# EAGLE design ECU_1A (EAGLE 7.7.0)
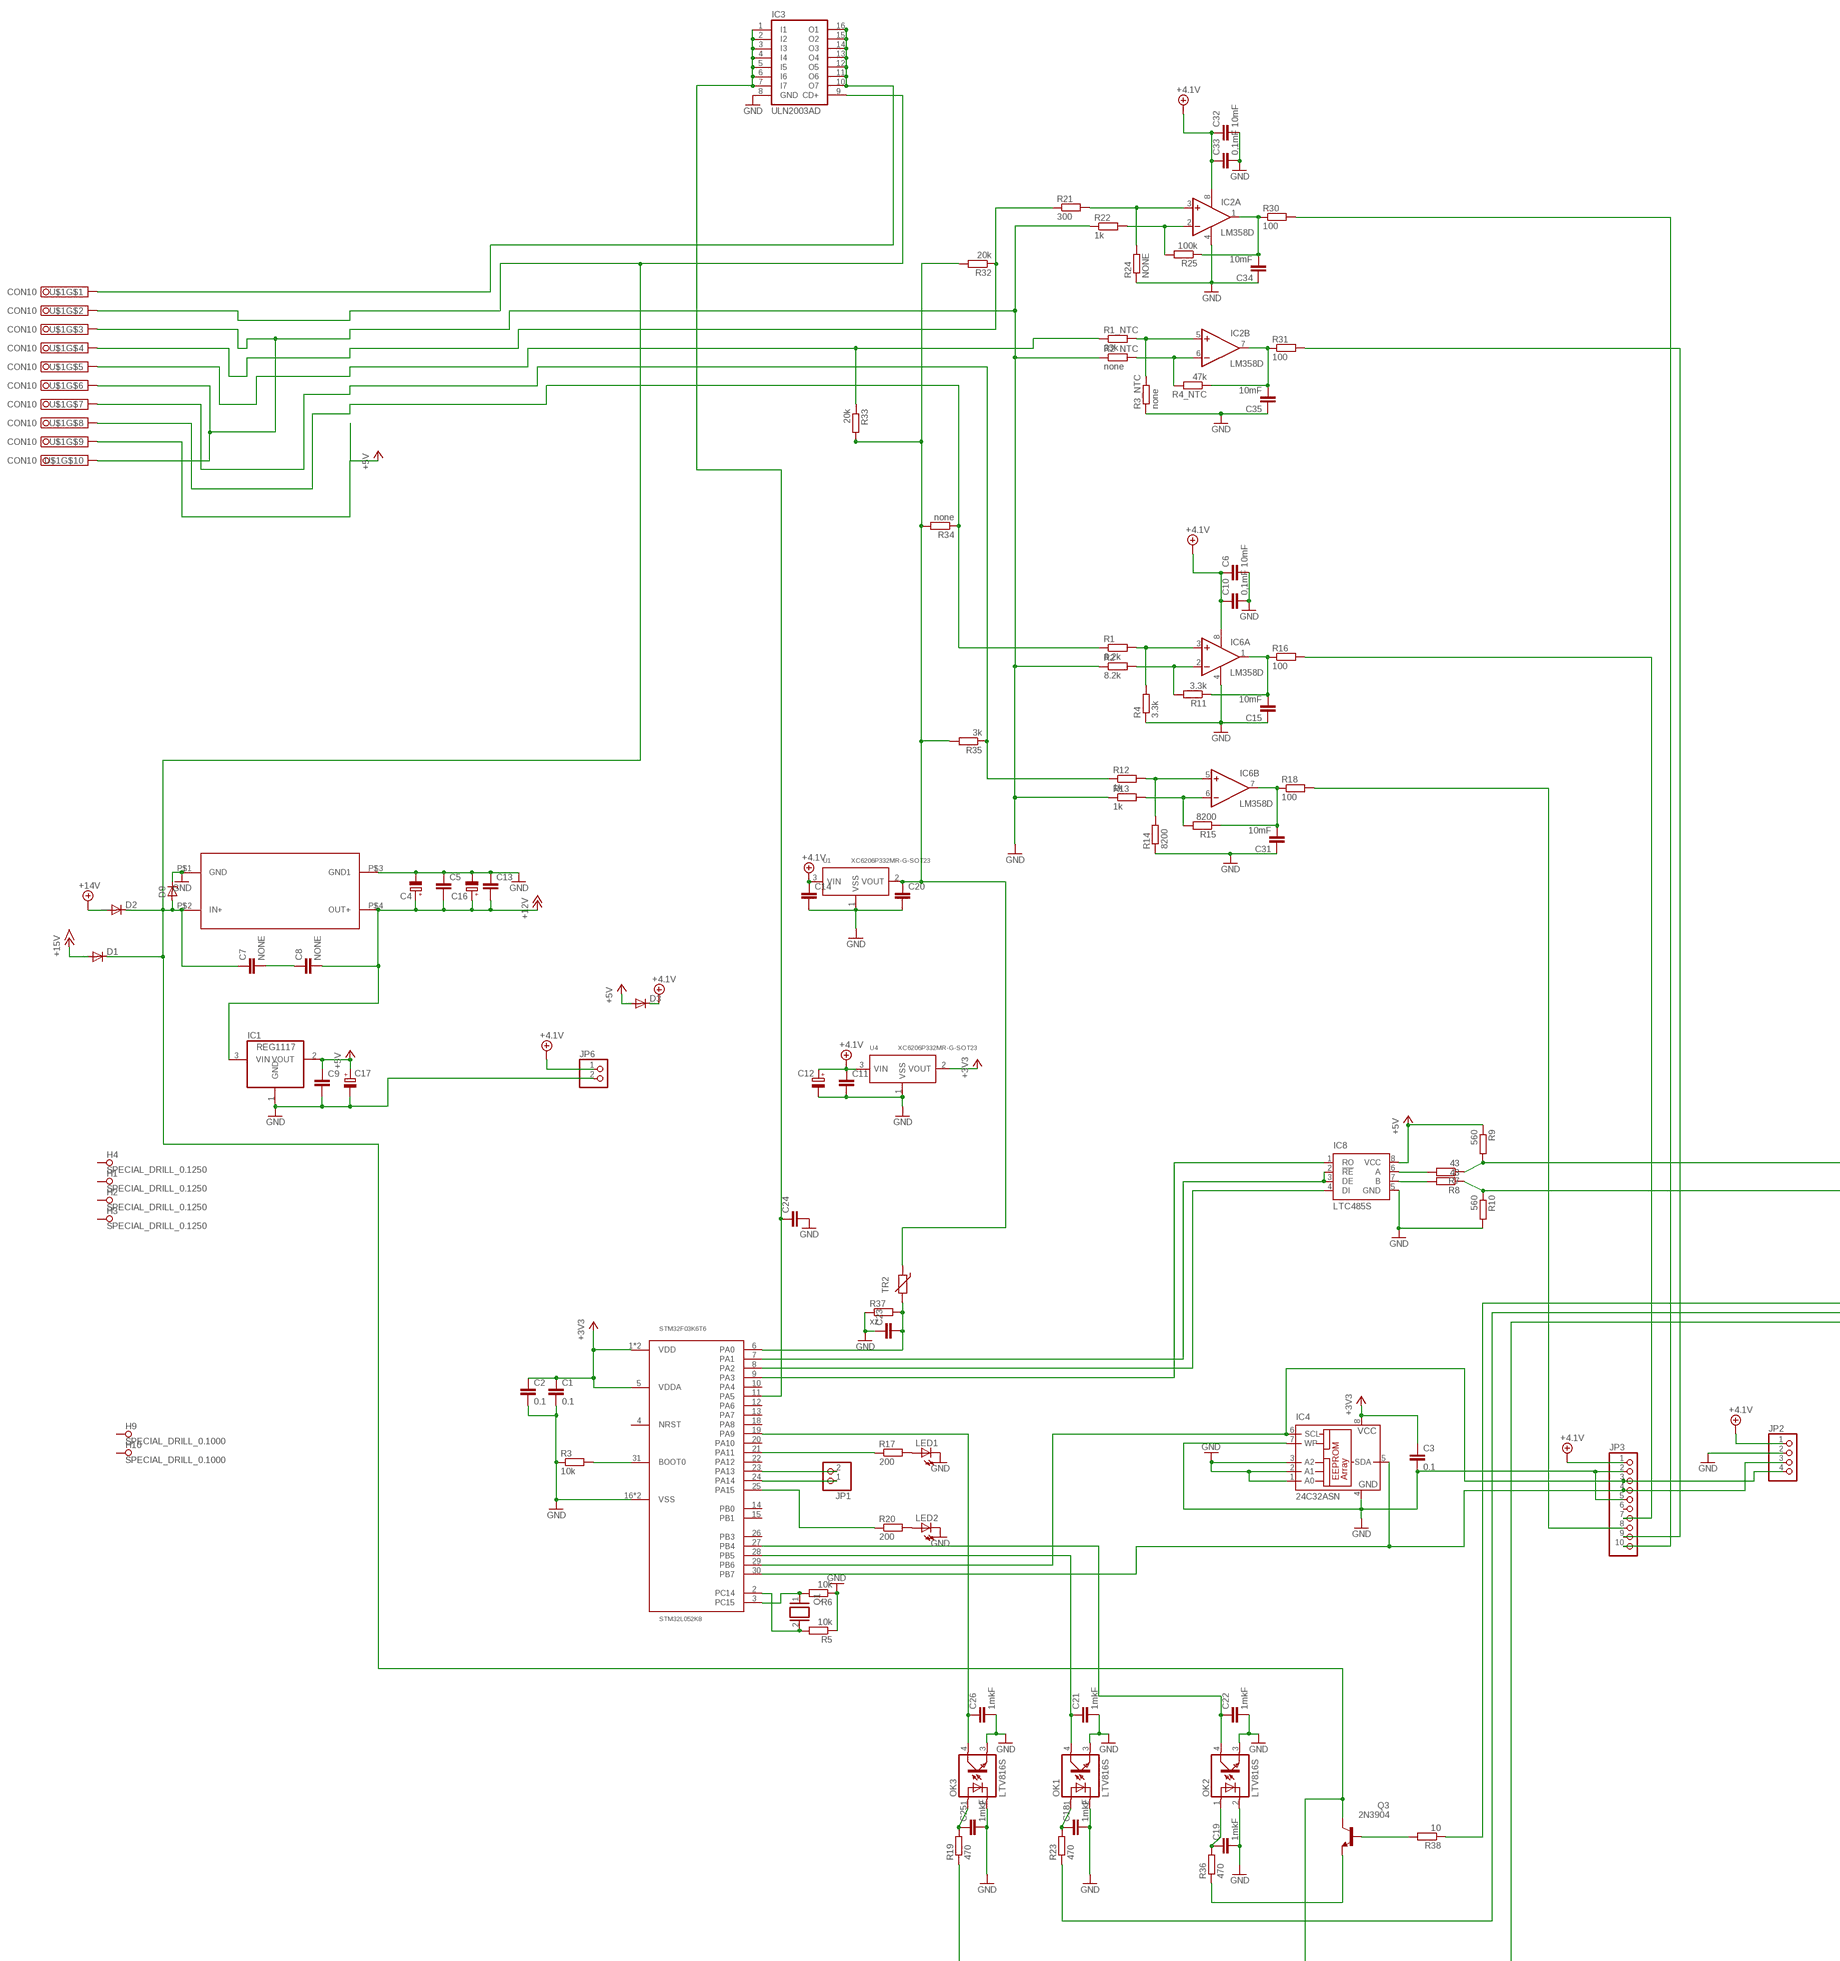
[diagram p0: schematic, sheet 1, part 1 of 3]
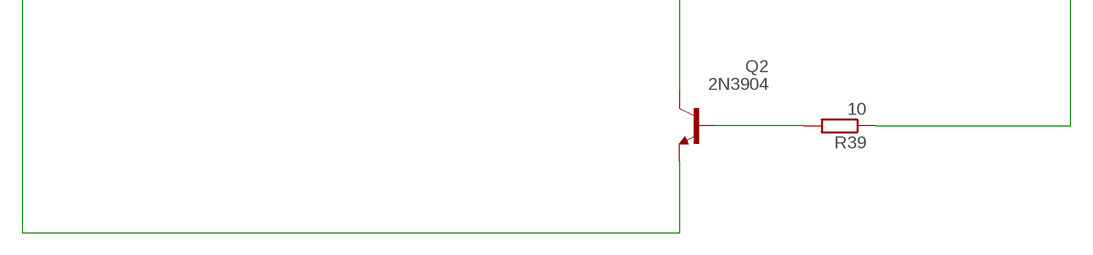
[diagram p1: schematic, sheet 1, part 2 of 3]
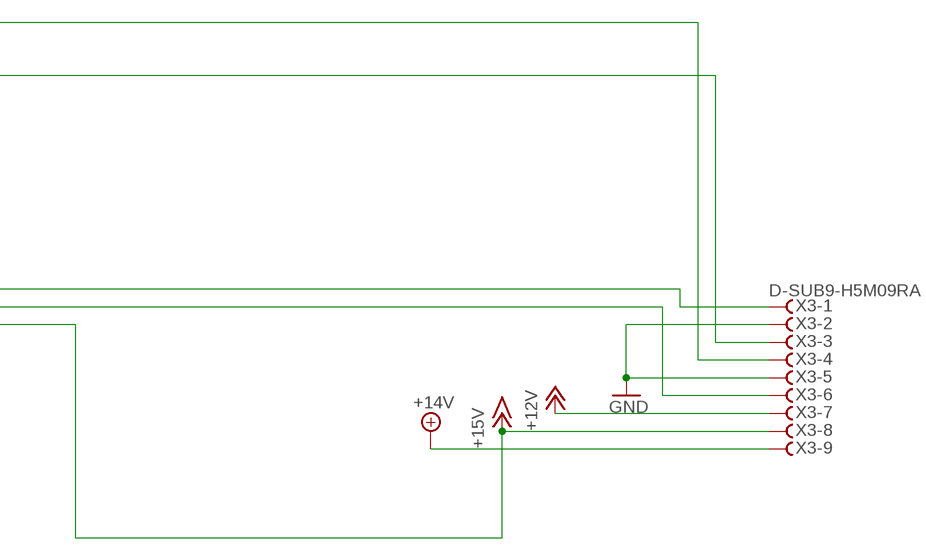
[diagram p2: schematic, sheet 1, part 3 of 3]

## Parts
C1  0.1  C-EUC0805  [C0805]
C2  0.1  C-EUC0805  [C0805]
C3  0.1  C-EUC0805  [C0805]
C4  CPOL-EUE2.5-6  [E2,5-6]
C5  C-EUC0805  [C0805]
C6  10mF  C-EUC0805  [C0805]
C7  NONE  C-EUC0805  [C0805]
C8  NONE  C-EUC0805  [C0805]
C9  C-EUC0805  [C0805]
C10  0,1mF  C-EUC0805  [C0805]
C11  C-EUC0805  [C0805]
C12  CPOL-EUE2.5-6  [E2,5-6]
C13  C-EUC0805  [C0805]
C14  C-EUC0805  [C0805]
C15  10mF  C-EUC0805  [C0805]
C16  CPOL-EUE5-10.5  [E5-10,5]
C17  CPOL-EUE2,5-6E  [E2,5-6E]
C18  1mkF  C-EUC0805  [C0805]
C19  1mkF  C-EUC0805  [C0805]
C20  C-EUC0805  [C0805]
C21  1mkF  C-EUC0805  [C0805]
C22  1mkF  C-EUC0805  [C0805]
C23  C-EUC0805  [C0805]
C24  C-EUC0805  [C0805]
C25  1mkF  C-EUC0805  [C0805]
C26  1mkF  C-EUC0805  [C0805]
C31  10mF  C-EUC0805  [C0805]
C32  10mF  C-EUC0805  [C0805]
C33  0,1mF  C-EUC0805  [C0805]
C34  10mF  C-EUC0805  [C0805]
C35  10mF  C-EUC0805  [C0805]
D1  DIODE-DO-214AC  [DO-214AC]
D2  DIODE-DO-214AC  [DO-214AC]
D3  DIODE-DO-214AC  [DO-214AC]
D9  ZENER-DIODEZD-7.5  [ZDIO-7.5]
H1  SPECIAL_DRILL_0.1250  [PAD_0.1250]
H2  SPECIAL_DRILL_0.1250  [PAD_0.1250]
H3  SPECIAL_DRILL_0.1250  [PAD_0.1250]
H4  SPECIAL_DRILL_0.1250  [PAD_0.1250]
H9  SPECIAL_DRILL_0.1000  [PAD_0.1000]
H10  SPECIAL_DRILL_0.1000  [PAD_0.1000]
IC1  REG1117  [SOT223]
IC2  LM358D  [SO08]
IC3  ULN2003AD  [SO16]
IC4  24C32ASN  [SO-08]
IC6  LM358D  [SO08]
IC8  LTC485S  [SOIC8]
JP1  PINHD-1X2  [1X02]
JP2  PINHD-1X4  [1X04]
JP3  PINHD-1X10  [1X10]
JP6  PINHD-1X2  [1X02]
LED1  LEDCHIPLED_1206  [CHIPLED_1206]
LED2  LEDCHIPLED_1206  [CHIPLED_1206]
OK1  LTV816S  [SMD4]
OK2  LTV816S  [SMD4]
OK3  LTV816S  [SMD4]
Q1  XTAL/S  [QS]
Q2  2N3904  [TO92]
Q3  2N3904  [TO92]
R1  8.2k  R-EU_R0805  [R0805]
R1_NTC  33k  R-EU_R0805  [R0805]
R2  8.2k  R-EU_R0805  [R0805]
R2_NTC  none  R-EU_R0805  [R0805]
R3  10k  R-EU_R0805  [R0805]
R3_NTC  none  R-EU_R0805  [R0805]
R4  3.3k  R-EU_R0805  [R0805]
R4_NTC  47k  R-EU_R0805  [R0805]
R5  10k  R-EU_R0805  [R0805]
R6  10k  R-EU_R0805  [R0805]
R7  43  R-EU_R0805  [R0805]
R8  43  R-EU_R0805  [R0805]
R9  560  R-EU_R0805  [R0805]
R10  560  R-EU_R0805  [R0805]
R11  3.3k  R-EU_R0805  [R0805]
R12  1k  R-EU_R0805  [R0805]
R13  1k  R-EU_R0805  [R0805]
R14  8200  R-EU_R0805  [R0805]
R15  8200  R-EU_R0805  [R0805]
R16  100  R-EU_R0805  [R0805]
R17  200  R-EU_R0805  [R0805]
R18  100  R-EU_R0805  [R0805]
R19  470  R-EU_R0805  [R0805]
R20  200  R-EU_R0805  [R0805]
R21  300  R-EU_R0805  [R0805]
R22  1k  R-EU_R0805  [R0805]
R23  470  R-EU_R0805  [R0805]
R24  NONE  R-EU_R0805  [R0805]
R25  100k  R-EU_R0805  [R0805]
R30  100  R-EU_R0805  [R0805]
R31  100  R-EU_R0805  [R0805]
R32  20k  R-EU_R0805  [R0805]
R33  20k  R-EU_R0805  [R0805]
R34  none  R-EU_R0805  [R0805]
R35  3k  R-EU_R0805  [R0805]
R36  470  R-EU_R0805  [R0805]
R37  xz  R-EU_R0805  [R0805]
R38  10  R-EU_R0805  [R0805]
R39  10  R-EU_R0805  [R0805]
STM32F03K6T6  STM32L052K8  [LQFP32-7X7]
TR2  THERMISTOR_R-2,5  [RS-2,5]
U1  XC6206P332MR-G-SOT23  PMIC-LDO-XC6206P332MR-G(SOT23)  [SOT-23]
U4  XC6206P332MR-G-SOT23  PMIC-LDO-XC6206P332MR-G(SOT23)  [SOT-23]
U$1  CON10  [CON10]
U$2  DC24_DC5  [SLIM_MOUNT]
X3  D-SUB9-H5M09RA  [H5M09RA]

## Nets
3.3V_SENSORS: C20.1 R32.2 R33.2 R34.2 R35.2 TR2.1 U1.2(VOUT)
+3V3: C1.1 C2.1 C3.1 IC4.8(VCC) STM32F03K6T6.1(VDD) STM32F03K6T6.5(VDDA) STM32F03K6T6.17(VDD) U4.2(VOUT)
+4.1V: C6.1 C10.1 C11.1 C12.+ C14.1 C32.1 C33.1 D3.C IC2.8(P:V+) IC6.8(P:V+) JP2.1 JP3.1 JP6.1 U1.3(VIN) U4.3(VIN)
+5V: C9.1 C17.+ D3.A IC1.2(VOUT) IC8.8(VCC) R9.1 U$1.9
+12V: C4.+ C5.2 C8.2 C13.2 C16.+ IC1.3(VIN) U$2.P$4(OUT+) X3.7
+14V: D2.A X3.9
+15V: D1.A R39.1 X3.8
A: IC8.6(A) R7.2
A1_5V_PRESS: JP3.7 R16.2
A3_NTC_10K: JP3.9 R31.2
A4_TERMO_K-TYPE: JP3.10 R30.2
AIN_3: R1_NTC.1 R33.1 U$1.5
AIN_4: R21.1 R32.1 U$1.4
B: IC8.7(B) R8.2
DE_UART: IC8.2(!RE) IC8.3(DE) STM32F03K6T6.7(PA1)
DI1_IN: C21.1 OK1.4(COL) STM32F03K6T6.28(PB5)
DI2_IN: C22.1 OK2.4(COL) STM32F03K6T6.27(PB4)
DI3_IN: C26.1 OK3.4(COL) STM32F03K6T6.19(PA9)
DI_1: R23.1 X3.6
DI_2: R38.1 X3.1
FLVL: JP3.8 R18.2
GND: C1.2 C2.2 C3.2 C4.- C5.1 C6.2 C9.2 C10.2 C11.2 C12.- C13.1 C14.2 C15.1 C16.- C17.- C18.2 C19.2 C20.2 C21.2 C22.2 C23.1 C24.2 C25.2 C26.2 C31.1 C32.2 C33.2 C34.1 C35.1 D9.C IC1.1(GND) IC2.4(P:V-) IC3.8(GND) IC4.1(A0) IC4.2(A1) IC4.3(A2) IC4.4(GND) IC4.7(WP) IC6.4(P:V-) IC8.5(GND) JP2.2 JP3.2 JP3.5 JP6.2 LED1.C LED2.C OK1.2(C) OK1.3(EMIT) OK2.2(C) OK2.3(EMIT) OK3.2(C) OK3.3(EMIT) R2.1 R2_NTC.1 R3.1 R3_NTC.1 R4.1 R5.1 R6.1 R10.2 R13.1 R14.1 R22.1 R24.1 R37.1 STM32F03K6T6.16(VSS) STM32F03K6T6.32(VSS) U1.1(VSS) U4.1(VSS) U$1.3 U$1.6 U$1.10 U$2.P$1(GND) U$2.P$3(GND1) X3.2 X3.5
LED1: R17.1 STM32F03K6T6.21(PA11)
LED2: R20.1 STM32F03K6T6.25(PA15)
N$1: Q1.2 R5.2 STM32F03K6T6.2(PC14)
N$2: C7.2 C8.1
N$3: R3.2 STM32F03K6T6.31(BOOT0)
N$4: C25.1 OK3.1(A) R19.2
N$5: Q1.1 R6.2 STM32F03K6T6.3(PC15)
N$6: IC6.3(A:+IN) R1.2 R4.2
N$9: JP1.2 STM32F03K6T6.23(PA13)
N$10: LED1.A R17.2
N$11: LED2.A R20.2
N$13: C19.1 OK2.1(A) R36.2
N$14: C18.1 OK1.1(A) R23.2
N$16: IC6.2(A:-IN) R2.2 R11.2
N$17: C23.2 R37.2 STM32F03K6T6.6(PA0) TR2.2
N$19: JP1.1 STM32F03K6T6.24(PA14)
N$20: Q3.3(E) R36.1
N$21: Q3.2(B) R38.2
N$22: C15.2 IC6.1(A:OUT) R11.1 R16.1
N$23: R12.1 R35.1 U$1.7
N$24: Q2.2(B) R39.2
N$25: IC2.3(A:+IN) R21.2 R24.2
N$26: IC6.5(B:+IN) R12.2 R14.2
N$27: IC6.6(B:-IN) R13.2 R15.2
N$28: R1.1 R34.1 U$1.8
N$29: Q2.3(E) R19.1
N$30: C31.2 IC6.7(B:OUT) R15.1 R18.1
N$31: IC2.2(A:-IN) R22.2 R25.2
N$32: C34.2 IC2.1(A:OUT) R25.1 R30.1
N$35: IC2.5(B:+IN) R1_NTC.2 R3_NTC.2
N$36: IC2.6(B:-IN) R2_NTC.2 R4_NTC.2
N$39: C35.2 IC2.7(B:OUT) R4_NTC.1 R31.1
PLUS_12: C7.1 D1.C D2.C D9.A IC3.9(CD+) Q2.1(C) Q3.1(C) U$1.2 U$2.P$2(IN+)
REL: C24.1 IC3.1(I1) IC3.2(I2) IC3.3(I3) IC3.4(I4) IC3.5(I5) IC3.6(I6) IC3.7(I7) STM32F03K6T6.11(PA5)
RELAY_OUT: IC3.10(O7) IC3.11(O6) IC3.12(O5) IC3.13(O4) IC3.14(O3) IC3.15(O2) IC3.16(O1) U$1.1
RS_A: R7.1 R9.2 X3.4
RS_B: R8.1 R10.1 X3.3
RX: IC8.1(RO) STM32F03K6T6.9(PA3)
SCL: IC4.6(SCL) JP2.4 JP3.3 STM32F03K6T6.29(PB6)
SDA: IC4.5(SDA) JP2.3 JP3.4 STM32F03K6T6.30(PB7)
TX: IC8.4(DI) STM32F03K6T6.8(PA2)
Unconnected: H1.1 H2.1 H3.1 H4.1 H9.1 H10.1 JP3.6 STM32F03K6T6.4(NRST) STM32F03K6T6.10(PA4) STM32F03K6T6.12(PA6) STM32F03K6T6.13(PA7) STM32F03K6T6.14(PB0) STM32F03K6T6.15(PB1) STM32F03K6T6.18(PA8) STM32F03K6T6.20(PA10) STM32F03K6T6.22(PA12) STM32F03K6T6.26(PB3)

## Library data of the parts
C1-C3 C18 C19 C21 C22 C25 C26 = rcl:C-EU: CAPACITOR, European symbol
C4 C12 = home_plc2:CPOL-EU: POLARIZED CAPACITOR, European symbol
C5-C11 C13-C15 C20 C23 C24 C31-C35 = home_plc2:C-EU: CAPACITOR, European symbol
C16 C17 = rcl:CPOL-EU: POLARIZED CAPACITOR, European symbol
D1-D3 = diode:DIODE-: DIODE
D9 = diode:ZENER-DIODE: Z-Diode
H1-H4 H9 H10 = special-drill:SPECIAL_DRILL_: Special drills
IC1 = burr-brown:REG1117: 800mA and 1A Low Dropout (LDO) Positive Regulator 1.8V, 2.5V, 2.85V, 3.3V, 5V, and Adj; MPN: REG1117; OC_FARNELL: 1097566; OC_NEWARK: 14P6981
IC2 IC6 = linear:LM358: OP AMP also LM158; LM258; LM2904 Source: http://cache.national.com/ds/LM/LM158.pdf
IC3 = uln-udn:ULN2003A: DRIVER ARRAY
IC4 = microchip:24*: Serial EEPROM I2C; MPN: IS24C32A-2GLI; OC_FARNELL: 1224413; OC_NEWARK: 43M4588
IC8 = home_plc2:LTC485: Low Power RS485 Interface Transceiver Source: http://www.linear.com/pc/downloadDocument.do?navId=H0,C1,C1007,C1017,P2064,D1718; OC_FARNELL: unknown; OC_NEWARK: unknown
JP1 JP6 = pinhead:PINHD-1X2: PIN HEADER
JP2 = pinhead:PINHD-1X4: PIN HEADER
JP3 = pinhead:PINHD-1X10: PIN HEADER
LED1 LED2 = led:LED: LED OSRAM: - CHIPLED LG R971, LG N971, LY N971, LG Q971, LY Q971, LO R971, LY R971 LH N974, LH R974 LS Q976, LO Q976, LY Q976 LO Q996 - Hyper CHIPLED LW Q18S LB Q993, LB Q99A, LB R99A - SideLED LS A670, LO A670, LY A670, LG A670, LP A670 LB A673, LV A673, LT A673, LW A673 LH A674 LY A675 LS A676, LA A676, LO A676, LY A676, LW A676 LS A679, LY A679, LG A679 - Hyper Micro SIDELED® LS Y876, LA Y876, LO Y876, LY Y876 LT Y87S - SmartLED LW L88C, LW L88S LB L89C, LB L89S, LG L890 LS L89K, LO L89K, LY L89K LS L896, LA L896, LO L896, LY L896 - TOPLED LS T670, LO T670, LY T670, LG T670, LP T670 LSG T670, LSP T670, LSY T670, LOP T670, LYG T670 LG T671, LOG T671, LSG T671 LB T673, LV T673, LT T673, LW T673 LH T674 LS T676, LA T676, LO T676, LY T676, LB T676, LH T676, LSB T676, LW T676 LB T67C, LV T67C, LT T67C, LS T67K, LO T67K, LY T67K, LW E67C LS E67B, LA E67B, LO E67B, LY E67B, LB E67C, LV E67C, LT E67C LW T67C LS T679, LY T679, LG T679 LS T770, LO T770, LY T770, LG T770, LP T770 LB T773, LV T773, LT T773, LW T773 LH T774 LS E675, LA E675, LY E675, LS T675 LS T776, LA T776, LO T776, LY T776, LB T776 LHGB T686 LT T68C, LB T68C - Hyper Mini TOPLED® LB M676 - Mini TOPLED Santana® LG M470 LS M47K, LO M47K, LY M47K Source: http://www.osram.convergy.de LUXEON: - LUMILED® LXK2-PW12-R00, LXK2-PW12-S00, LXK2-PW14-U00, LXK2-PW14-V00 LXK2-PM12-R00, LXK2-PM12-S00, LXK2-PM14-U00 LXK2-PE12-Q00, LXK2-PE12-R00, LXK2-PE12-S00, LXK2-PE14-T00, LXK2-PE14-U00 LXK2-PB12-K00, LXK2-PB12-L00, LXK2-PB12-M00, LXK2-PB14-N00, LXK2-PB14-P00, LXK2-PB14-Q00 LXK2-PR12-L00, LXK2-PR12-M00, LXK2-PR14-Q00, LXK2-PR14-R00 LXK2-PD12-Q00, LXK2-PD12-R00, LXK2-PD12-S00 LXK2-PH12-R00, LXK2-PH12-S00 LXK2-PL12-P00, LXK2-PL12-Q00, LXK2-PL12-R00 Source: www.luxeon.com KINGBRIGHT: KA-3528ASYC Source: www.kingbright.com
OK1-OK3 = optocoupler:LTV816: OPTO COUPLER Source: LITEON, LTV816.pdf; OC_FARNELL: unknown; OC_NEWARK: unknown
Q1 = special:XTAL/S: CRYSTAL
Q2 Q3 = transistor-npn:2N3904: NPN Transistor
R1 R1_NTC R2 R2_NTC R3 R3_NTC R4 R4_NTC R5-R25 R30-R39 = rcl:R-EU_: RESISTOR, European symbol
STM32F03K6T6 = stm8s103:STM32L052K8*
TR2 = discrete:THERMISTOR_: Thermo Resistor
U1 U4 = Seeed-OPL-ic:PMIC-LDO-XC6206P332MR-G(SOT23): 310030099; MPN: XC6206P332MR-G
U$1 = con-phoenix-350:CON10
U$2 = burr-brown:DC24_DC5
X3 = con-thomas-betts:D-SUB9-: D-Subminiatur Connector Source: Electronioc Interconnects European Edition 1998; OC_FARNELL: unknown; OC_NEWARK: unknown

## Net classes
0 default: clearance 0.205 mm

## Board
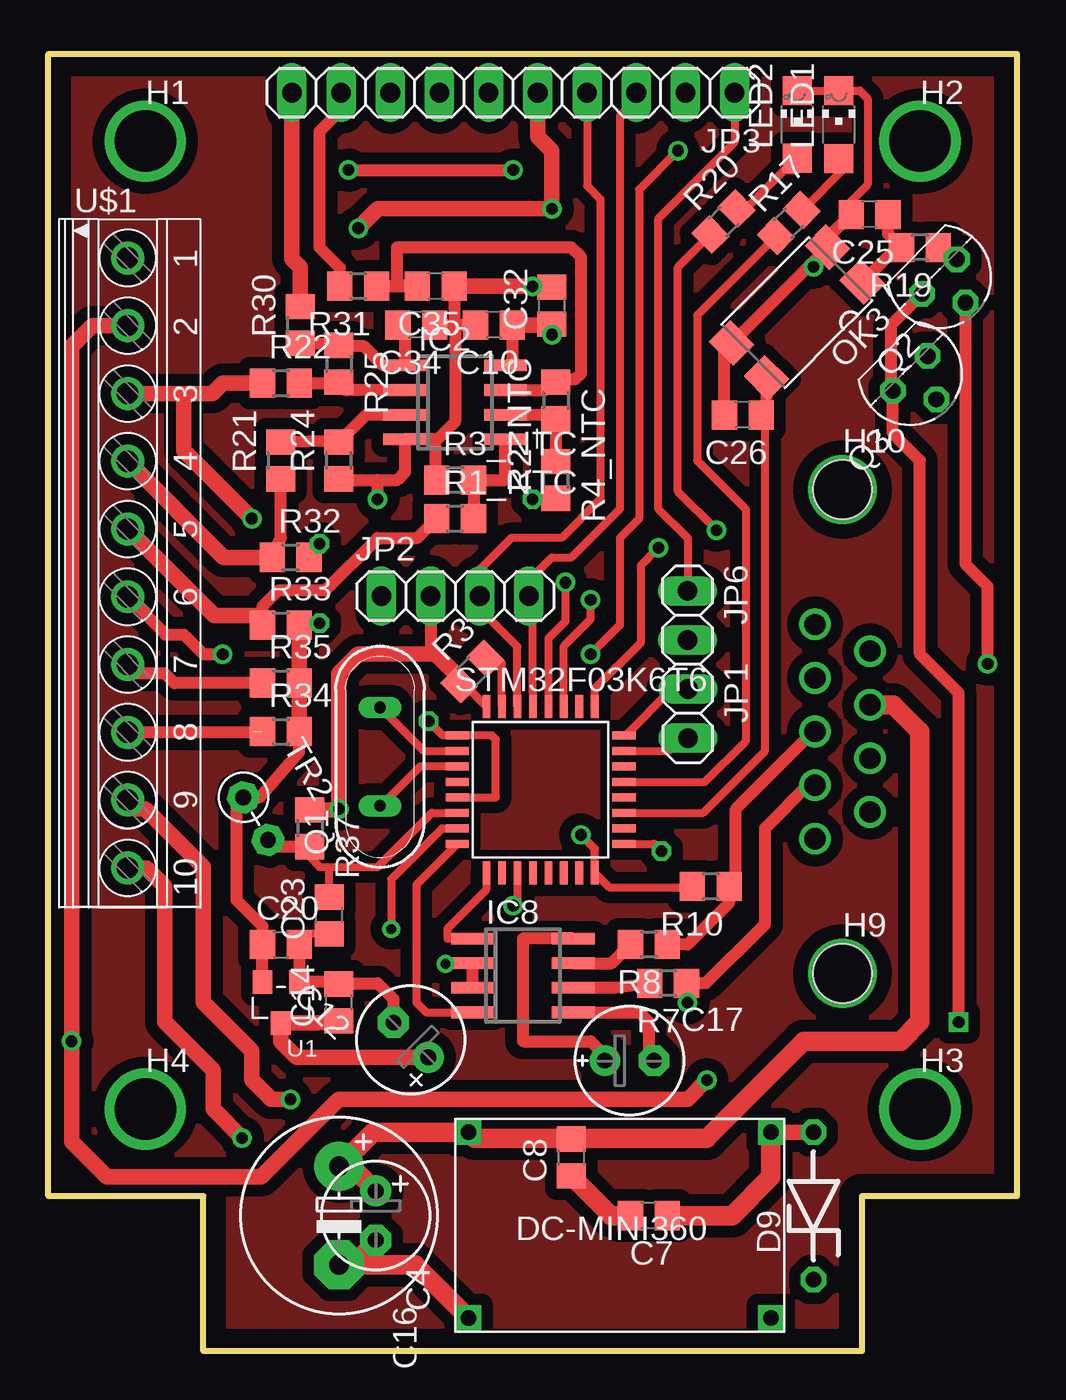
[diagram p3: board, top side]
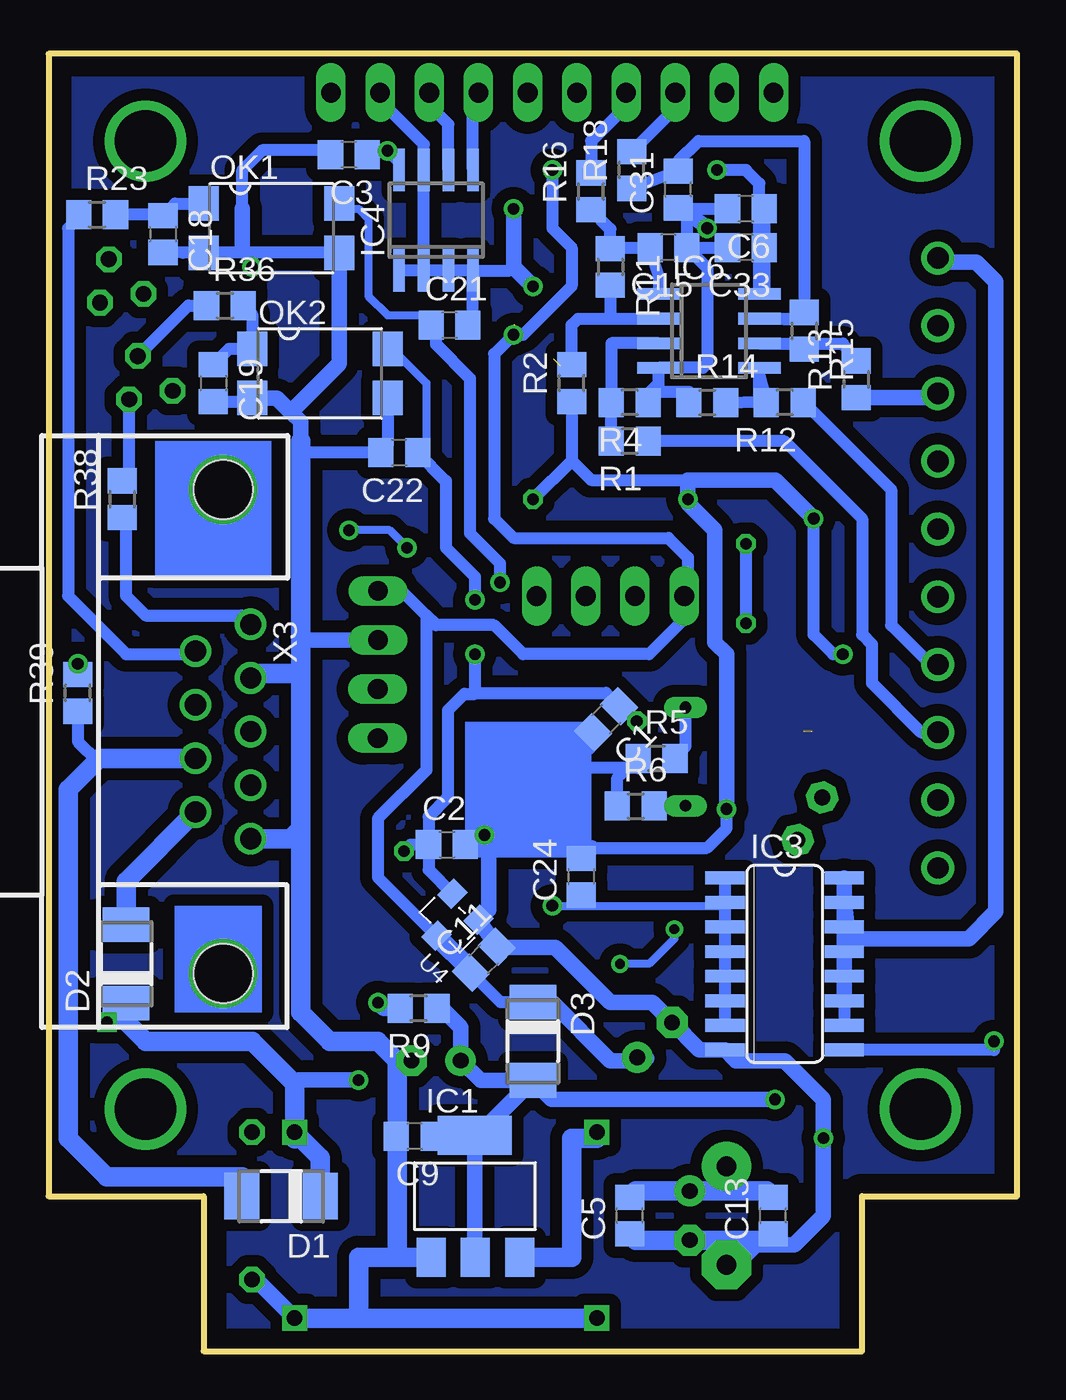
[diagram p4: board, bottom side, seen from below]

Size 50 x 67 mm. Coordinates in mm from the lower left corner, seen from the top.
Outline: 0,67 50,67 50,8 42,8 42,0 8,0 8,8 0,8 0,67
Copper layers (1*16): Top 0.035mm / dielectric 1.5mm / Bottom 0.035mm
Design rules "default": minimum track width 10mil, minimum drill 24mil, track to track 8mil, track to pad 8mil, pad to pad 8mil, via to via 8mil, smd to smd 8mil, copper to edge 40mil, drill to drill 8mil, minimum pad ring 10mil, minimum via ring 8mil, stop-mask expansion 4mil, vias tented up to drill 0mil, thermal gap 10mil

### Footprints (pad centres in the part's own frame; a part is rotated, then mirrored left to right if it is on the bottom)
C0805 = smd 1.3 x 1.5: 1 -0.95,0; 2 0.95,0
E2,5-6 = drill 0.813 pad 1.6: + -1.27,0 | drill 0.813 pad 1.6 octagon: - 1.27,0
E5-10,5 = drill 1.016 pad 2.54: + -2.54,0 | drill 1.016 pad 2.54 octagon: - 2.54,0
E2,5-6E = drill 0.813 pad 1.575: + -1.27,0 | drill 0.813 pad 1.575 octagon: - 1.27,0
DO-214AC = smd 1.8 x 2.4: A 2.025,0; C -2.025,0
ZDIO-7.5 = drill 0.813 octagon: A 3.81,0; C -3.81,0
PAD_0.1250 = drill 3.175 pad 3.175: 1 0,0
PAD_0.1000 = drill 2.54 pad 2.54: 1 0,0
SOT223 = smd 1.499 x 2.007: 1 -2.261,-3.15; 2 0.025,-3.15; 3 2.311,-3.15 | smd 3.81 x 2.007: 4 0,3.15
SO08 = smd 0.6 x 2.2: 1 -1.905,-2.6; 2 -0.635,-2.6; 3 0.635,-2.6; 4 1.905,-2.6; 5 1.905,2.6; 6 0.635,2.6; 7 -0.635,2.6; 8 -1.905,2.6
SO16 = smd 0.66 x 2.032: 1 -4.445,-3.073; 2 -3.175,-3.073; 3 -1.905,-3.073; 4 -0.635,-3.073; 5 0.635,-3.073; 6 1.905,-3.073; 7 3.175,-3.073; 8 4.445,-3.073; 9 4.445,3.073; 10 3.175,3.073; 11 1.905,3.073; 12 0.635,3.073; 13 -0.635,3.073; 14 -1.905,3.073; 15 -3.175,3.073; 16 -4.445,3.073
SO-08 = smd 0.6 x 2.2: 1 -1.905,-2.6; 2 -0.635,-2.6; 3 0.635,-2.6; 4 1.905,-2.6; 5 1.905,2.6; 6 0.635,2.6; 7 -0.635,2.6; 8 -1.905,2.6
SOIC8 = smd 0.6 x 2.2: 1 -1.905,-2.6; 2 -0.635,-2.6; 3 0.635,-2.6; 4 1.905,-2.6; 5 1.905,2.6; 6 0.635,2.6; 7 -0.635,2.6; 8 -1.905,2.6
1X02 = drill 1.016 long: 1 -1.27,0; 2 1.27,0
1X04 = drill 1.016 long: 1 -3.81,0; 2 -1.27,0; 3 1.27,0; 4 3.81,0
1X10 = drill 1.016 long: 1 -11.43,0; 2 -8.89,0; 3 -6.35,0; 4 -3.81,0; 5 -1.27,0; 6 1.27,0; 7 3.81,0; 8 6.35,0; 9 8.89,0; 10 11.43,0
CHIPLED_1206 = smd 1.5 x 1.5: A 0,-1.75; C 0,1.75
SMD4 = smd 1.78 x 1.55: 1 -1.27,-3.5; 2 1.27,-3.5; 3 1.27,3.5; 4 -1.27,3.5
QS = drill 0.61 long: 1 -2.54,0; 2 2.54,0
TO92 = drill 0.813 octagon: 1 1.27,0; 2 0,1.905; 3 -1.27,0
R0805 = smd 1.3 x 1.5: 1 -0.95,0; 2 0.95,0
LQFP32-7X7 = smd 1.2 x 0.4: 1 -4.3,2.8; 2 -4.3,2; 3 -4.3,1.2; 4 -4.3,0.4; 5 -4.3,-0.4; 6 -4.3,-1.2; 7 -4.3,-2; 8 -4.3,-2.8; 17 4.3,-2.8; 18 4.3,-2; 19 4.3,-1.2; 20 4.3,-0.4; 21 4.3,0.4; 22 4.3,1.2; 23 4.3,2; 24 4.3,2.8 | smd 0.4 x 1.2: 9 -2.8,-4.3; 10 -2,-4.3; 11 -1.2,-4.3; 12 -0.4,-4.3; 13 0.4,-4.3; 14 1.2,-4.3; 15 2,-4.3; 16 2.8,-4.3; 25 2.8,4.3; 26 2,4.3; 27 1.2,4.3; 28 0.4,4.3; 29 -0.4,4.3; 30 -1.2,4.3; 31 -2,4.3; 32 -2.8,4.3
RS-2,5 = drill 0.813 pad 1.6 octagon: 1 -1.27,0; 2 1.27,0
SOT-23 = smd 1.016 x 1.2: 1 -0.95,-1.06; 2 0.95,-1.06; 3 0,1.06
CON10 = drill 1.1 pad 1.7: 1 2.538,-3.91; 2 6.037,-3.91; 3 9.537,-3.91; 4 13.037,-3.91; 5 16.538,-3.91; 6 20.038,-3.91; 7 23.538,-3.91; 8 27.038,-3.91; 9 30.538,-3.91; 10 34.043,-3.91
SLIM_MOUNT = drill 0.8 square: P$1 0.7,10.3; P$2 0.7,0.7; P$3 16.3,10.3; P$4 16.3,0.7
H5M09RA = drill 1.092: 1 -5.537,1.422; 2 -2.769,1.422; 3 0,1.422; 4 2.769,1.422; 5 5.537,1.422; 6 -4.153,-1.422; 7 -1.384,-1.422; 8 1.384,-1.422; 9 4.153,-1.422 | hole 3.048: -12.497,0; 12.497,0

### Placement (x,y rotation side)
C1  21.22,32.64 225 bottom
C2  29.44,26.16 0 bottom
C3  34.5,61.79 180 bottom
C4  16.9,7 270 top
C5  20,7 90 bottom
C6  14,59 180 bottom
C7  31,7 180 top
C8  27,10 90 top
C9  31.1,11.1 180 bottom
C10  23,53 180 top
C11  27.54,20.22 45 bottom
C12  18.71,16.07 135 top
C13  12.6,7 90 bottom
C14  15,18 90 top
C15  18,57 180 bottom
C16  15,7 270 top
C17  30,15 0 top
C18  44.1,57.7 270 bottom
C19  41.5,50 270 bottom
C20  12,21 0 top
C21  29.31,53 0 bottom
C22  31.9,46.4 180 bottom
C23  14.5,22.5 90 top
C24  22.5,24.5 90 bottom
C25  42.4,58.7 180 top
C26  35.85,48.35 180 top
C31  17.5,60 90 bottom
C32  26,54 90 top
C33  14,57 180 bottom
C34  19,53 180 top
C35  20,55 180 top
D1  38,8 180 bottom
D2  46,20 90 bottom
D3  25,16 270 bottom
D9  39.5,7.5 90 top
H1  5,62.5 0 top
H2  45,62.5 0 top
H3  45,12.5 0 top
H4  5,12.5 0 top
H9  41,19.5 0 top
H10  41,44.5 0 top
IC1  28,8 0 bottom
IC2  21,49 270 top
IC3  12,20 270 bottom
IC4  30,58.41 0 bottom
IC6  15.91,52.69 270 bottom
IC8  24.5,19.4 270 top
JP1  33.02,32.93 270 top
JP2  21,39 0 top
JP3  24,65 180 top
JP6  33,38 270 top
LED1  40.81,63.35 0 top
LED2  38.65,63.35 0 top
OK1  38.5,58 270 bottom
OK2  36,50.5 270 bottom
OK3  38.65,53.65 135 top
Q1  17.12,30.71 90 top
Q2  46,55.5 225 top
Q3  44.5,50.5 225 top
R1  20,47 180 bottom
R1_NTC  21,43 0 top
R2  23,50 90 bottom
R2_NTC  26.2,45 90 top
R3  21.88,35.1 45 top
R3_NTC  21,45 0 top
R4  20,49 180 bottom
R4_NTC  26.2,49.1 270 top
R5  18.61,30.62 0 bottom
R6  19.69,28.15 0 bottom
R7  32,19 180 top
R8  31,21 180 top
R9  30.9,17.7 180 bottom
R10  34.2,24 180 top
R11  21,56 270 bottom
R12  12,49 180 bottom
R13  8.3,50.2 90 bottom
R14  16,49 0 bottom
R15  11,52.7 270 bottom
R16  22,59.9 90 bottom
R17  38.23,58.27 45 top
R18  19.9,61 90 bottom
R19  45,57 180 top
R20  34.85,58.34 45 top
R21  12,46 90 top
R22  12,50 0 top
R23  47.5,58.7 0 bottom
R24  15,46 90 top
R25  15,51 270 top
R30  13,53 90 top
R31  16,55 180 top
R32  12.5,41 0 top
R33  12,37.5 0 top
R34  12,32 0 top
R35  12,34.5 0 top
R36  40.9,54 0 bottom
R37  13.5,27 270 top
R38  46.2,44 90 bottom
R39  48.5,34 90 bottom
STM32F03K6T6  25.41,29 0 top
TR2  10.7,27.5 300 top
U1  12,18 180 top
U4  29.23,22.2 135 bottom
U$1  8,59 270 top
U$2  38,12 180 top
X3  41,32 270 bottom

### Tracks (layer width: path | path; a pad name or v marks a point on that pad's centre or on a via)
3.3V_SENSORS  (via drill 0.6)
  Top 0.61: v14,37.6 14,37.5 R33.2 | R32.2 13.5,41 v14,41.7 | U1.2 C20.1 11.05,21.95 9.7,23.3 9.7,28.34 TR2.1 10.9,28.6 12.95,30.95 R34.2
  Top 0.813: R34.2 R35.2 R33.2
  Bottom 0.61: v14,41.7 v14,37.6
+3V3  (via drill 0.6)
  Top 0.406: v19.64,32.54 20.37,31.8 STM32F03K6T6.1 22.9,31.8 23.1,31.6 23.1,28.6 STM32F03K6T6.5 | STM32F03K6T6.17 31.28,26.2 v31.66,25.82 | v32.5,62 30.5,60 30.5,43 29.5,42 29.5,37.5 v28,36
  Bottom 0.406: v19.64,32.54 19.64,32.52 C1.1
  Bottom 0.61: C2.1 30.39,24.86 U4.2 | v31.66,25.82 31.32,26.16 C2.1 | IC4.8 31.91,61.41 v32.5,62 33.34,62 C3.1 | v28,36 28,33.95 | C2.1 30.39,27.61 29.39,28.61 29.39,33.1 28.54,33.95 28,33.95 | 28,33.95 27.95,34 21.23,34 C1.1
+4.1V  (via drill 0.6)  (2 unrouted)
  Top 0.406: JP3.1 35.43,62.43 31.5,58.5 31.5,43.5 33,42 JP6.1
  Top 0.61: C10.1 23.95,51.26 | v15.5,61 v24,61
  Top 0.813: C32.1 v26,52.5 | C10.1 25.95,53 | C12.+ 12.83,15.17 12,16 U1.3 13.89,16.94 C14.1
  Bottom 0.61: 28.21,19.68 C11.1 26.68,18.02 D3.C | JP6.1 31.77,39.27 30.5,38 | 30.5,38 30.5,30 33,27.5 33,24.47 U4.3 | 30.5,38 30,37.5 27,37.5 25.5,36 19,36 17,38 17,39 | C6.1 C33.1 13.05,54.85 IC6.8 13.31,60.31 14,61 v15.5,61 | v24,61 24,58 23,57 23,55 25.5,52.5 v26,52.5 27,51.5 27,43 26,42 18,42 17,41 17,39 | JP2.1 17,39
  Bottom 0.813: D3.C 25.98,18 24,18 21,15 19.78,15 C12.+ 19.13,15.13
  Bottom 1.016: 28.21,19.68 U4.3
+5V  (via drill 0.6)
  Top 0.61: IC8.8 24.5,21.3 24.5,16 28,16 28.73,15.27 C17.+
  Top 0.813: v12.5,13 11.5,13 10.5,14 10.5,15.5 8,18 8,25 5,28 4.55,28 U$1.9
  Bottom 0.813: R9.1 29.7,17.7 28.73,16.73 C17.+ 27.7,13.97 D3.A | D3.A 26,13 28,11 | 28,11 28,4.88 IC1.2 | C9.1 28.1,11.1 28,11 | v12.5,13 24.02,13 D3.A
+12V
  Top 1.016: C4.+ 15.63,9.54 C16.+ 16.76,11.3 U$2.P$4 22,11 27,11 C8.2 arc-90 27.05,11 34,11 39,16 44,16 45,17 45,32 43.62,33.38 X3.7
  Bottom 1.016: C5.2 19.68,8.27 C4.+ 12.92,8.27 C13.2 | IC1.3 23,4.85 23,11 21.7,11 U$2.P$4
+14V
  Bottom 1.016: X3.9 46,24.27 D2.A
+15V
  Bottom 0.61: 49,29 48.5,29.5 | R39.1 48.5,31.5 47.5,30.5
  Bottom 1.016: D1.A 40,9 47,9 49,11 49,29 47.5,30.5 47.38,30.62 X3.8
A
  Top 0.61: R7.2 29.29,18.77 IC8.6
A1_5V_PRESS
  Bottom 0.61: JP3.7 20.19,64.31 22,62.5 R16.2
A3_NTC_10K
  Top 0.61: R31.2 15.05,55.95 14,57 14,63 15,64 15,64.89 JP3.9
A4_TERMO_K-TYPE
  Top 0.813: R30.2 13,56 12.57,56.43 JP3.10
AIN_3
  Top 0.406: 11.05,38.45 11,38.5
  Top 0.61: 20,43 R1_NTC.1 19.05,42 17,42 14.3,39.3 11.9,39.3 11.05,38.45 11.05,38 R33.1
  Top 0.813: U$1.5 8.55,38 11.05,38
AIN_4
  Top 0.61: 12,45 R21.1 12,42 11.55,41.05 R32.1
  Top 0.813: U$1.4 9.05,41 R32.1
B
  Top 0.61: IC8.7 29.09,20.04 R8.2
DE_UART  (via drill 0.5)
  Top 0.406: v20.5,20 22.4,20 IC8.2 | STM32F03K6T6.7 20.33,27 17.7,24.37 v17.7,21.8
  Top 0.61: IC8.3 IC8.2
  Bottom 0.406: v20.5,20 19,20 17.7,21.3 v17.7,21.8
DI1_IN  (via drill 0.6)
  Top 0.406: STM32F03K6T6.28 25.81,36.81 26.7,37.7 v26.7,39.7
  Bottom 0.406: OK1.4 34.73,59 34,59 33.5,58.5 33.5,54.5 32.5,53.5 30.5,53.5 30.5,53 C21.1
  Bottom 0.61: v26.7,39.7 26.7,40.7 28.25,42.25 28.25,50.25 30,52 30,52.74 C21.1 30.26,52.74
DI2_IN  (via drill 0.6)
  Top 0.406: STM32F03K6T6.27 26.61,36.41 28,37.8 v28,38.8
  Bottom 0.406: 32.23,52 32.23,51.73 30.5,50 30.5,46.85 C22.1
  Bottom 0.61: OK2.4 32.23,52 | v28,38.8 28,40 29.5,41.5 29.5,44.95 C22.1
DI3_IN
  Top 0.406: STM32F03K6T6.19 33.8,27.8 37,31 37,48.5 C26.1
  Top 0.61: OK3.4 37.07,48.62 C26.1
DI_1
  Bottom 0.61: X3.6 42.58,36 46,36 49,39 49,58 48.5,58.5 48.5,58.7 R23.1
DI_2
  Bottom 0.61: X3.1 40.04,38 45,38 46,39 46,42.85 R38.1
FLVL
  Bottom 0.61: JP3.8 17.65,64.2 R18.2
GND  (via drill 0.6)
  Top 0.406: STM32F03K6T6.32 21.51,34.41 R3.1 | v27.5,26.66 28.21,25.95 STM32F03K6T6.16 28.96,23.95 33.25,23.95 R10.2 | C23.1 12.95,21.55 C20.2 | LED2.C LED1.C 41.9,65.1 42.3,64.7 42.3,60.25 41.45,59.4 C25.2
  Top 0.61: R3_NTC.1 20,45 20,47 | 20,47 19.91,47.09 IC2.4 18.4,45.4 18,45 17,45 | C10.2 21,53 | C34.1 21,53 | 21,53 21,48 20,47 | R24.1 arc90 15.05,45 17,45 | 21,55 C35.1 20.95,53.05 21,53 | IC8.5 30.5,17.5 31,17 31,15.27 C17.- | 21.21,34.79 R3.1 | 39.5,56.27 OK3.3 34.9,51.7 C26.2 | 39.5,56.27 OK3.2 40.22,57.47 C25.2 | 39.5,56.27 v39.5,56 | R2_NTC.1 26.15,44 v25,44 | C20.2 U1.1 14.89,19.06 C14.2 15.05,19 17,19 17.81,18.19 C12.- | JP2.2 19.73,36.27 20,36 | v17,44 17,45 | 14.95,27.95 v15,28 | U$1.6 6.05,37 7,37 8,36 v9,36 | LED2.C
  Top 0.813: C32.2 26,55 v25,55 C35.1 | v16,58 17,59 v26,59 26,62 25.27,62.73 JP3.5 | 21.21,34.79 20,36 16,36 15,35 v15,28 15,27.95 R37.1 | R22.1 9,50 8.46,49.46 U$1.3 6.79,49.46 7,49.25 7,46.5 v10.5,43 | U$1.10 5.04,24.96 6,24 6,17 8.5,14.5 8.5,12.5 v10,11
  Top 1.016: C16.- 16,4.46 | 16,4.46 18.94,4.46 U$2.P$3 | C4.- 15.9,4.56 16,4.46
  Bottom 0.406: C24.2 22.5,26.5 24.79,28.79 | v27.5,26.66 27.45,26.16 27.29,26
  Bottom 0.61: IC4.4 IC4.3 IC4.2 | IC4.2 IC4.1 | IC4.2 IC4.7 30.64,62.34 32.5,64.2 32.5,64.61 JP3.2 | C11.2 26.81,20.84 | 18.51,50 18.51,49.56 16.95,49.56 R14.1 | 18.51,50 IC6.4 16.21,50.79 16,51 16,55.95 C15.1 | C15.1 C33.2 | C31.1 16.95,59 | 16.95,59 C6.2 | 16.95,59 17.05,58.9 C15.1 | C1.2 22.08,31.12 22.46,31.12 23.29,30.29 | R4.1 19.05,49.46 18.51,50 | 23.29,30.29 24.79,28.79 27.29,26.29 | 27.29,26.29 27.43,26.16 v27.5,26.66 C2.2 | 23.29,30.29 22.12,30.12 19.56,30.12 R5.1 20.64,29.62 R6.1 20.64,28.04 | 27.29,26 27.29,26.29 | IC4.4 26.19,55.81 26,56 | OK1.3 39.5,56.73 | 39.73,56.73 OK1.2 43.08,56.73 C18.2 | C19.2 39.82,49.05 OK2.2 | v39.5,56 39.5,56.73 | v25,44 23,46 | R2.1 23,46 | 23,46 22,45 17,45 | 21.95,26 16,26 15,27 v15,28 | v10.5,43 10.5,37 9.5,36 v9,36 | C21.2 28.09,53 IC4.4 | 37,46 37,46.4 C22.2 32.5,46.75 OK2.3 | 40,59 40,61 38.98,62.02 35.68,62.02 C3.2 | 39.5,56.73 39.73,56.73 | 39.73,56.73 40,57
  Bottom 0.813: X3.2 39.35,35 | 27.29,26 27.29,22.8 U4.1 26.81,20.84 23.84,20.84 21,18 18.84,18 C12.- 16.4,15.55 IC3.8 | 15,15.48 IC3.8 | v16,58 16,58.05 C31.1 | v26,59 26,56 v25,55 | JP6.2 36.73,36.73 37,37 | C17.- 32,15 | C9.2 32.05,11.95 32,12 | 40,57 40,59 | 21.95,26 C24.2 | v10.5,43 12.5,45 17,45 v17,44 17,43.8 15.6,42.4 15.6,36.6 15,36 v15,28 | C16.- 14.54,4.46 13.5,5.5 11.5,5.5 10,7 v10,11 10,13 12,15 14.52,15 IC3.8 | R13.1 4.3,49.25 U$1.3 | 37,47 37,48 37.5,48.5 | 37.5,48.5 38.23,49.23 OK2.2 | OK1.3 35,51 37.5,48.5 | D9.C 39.29,3.69 U$2.P$1
  Bottom 1.016: U$2.P$3 34,1.7 | 34,1.7 U$2.P$1 | C5.1 19.68,5.73 C4.- 12.92,5.73 C13.1 | 34,1.7 34,4.85 32,4.85 | 32,4.85 IC1.1 | 39.35,35 37,35 | 37,35 37,27 | 37,27 37.54,26.46 X3.5 | 37,35 37,37 37,46 37,47 | 37,27 37,17.5 35.5,16 33,16 32,15 32,12 32,4.85
LED1
  Top 0.406: STM32F03K6T6.21 33.9,29.4 36,31.5 36,43.5 33.5,46 33.5,53.5 37.5,57.5 37.45,57.5 R17.1
LED2  (via drill 0.6)
  Top 0.406: STM32F03K6T6.25 28.21,34.21 30.6,36.6 30.6,40.6 v31.5,41.5 | v34.5,42.4 32.5,44.4 32.5,55.99 R20.1
  Bottom 0.406: v31.5,41.5 32.4,42.4 v34.5,42.4
N$1
  Top 0.406: STM32F03K6T6.2 19.37,31 Q1.2
  Bottom 0.61: R5.2 17.66,30.7 17.12,31.25 Q1.2
N$2
  Top 1.016: C8.1 29.05,7 C7.2
N$3
  Top 0.406: STM32F03K6T6.31 23.41,35.52 R3.2
N$4
  Top 0.61: 43.95,57.1 R19.2 | 43.95,57.1 43.9,57.1 OK3.1 | 43.95,57.1 43.35,57.7 C25.1
N$5
  Top 0.406: STM32F03K6T6.3 19.2,30.2 17.12,28.12 Q1.1
  Bottom 0.61: R6.2 18.1,28.15 Q1.1
N$6
  Bottom 0.61: IC6.3 20.95,52.06 R4.2 21,49 R1.2
N$7
  pour Bottom (isolate 0.61): 0,8 8,8 8,0 42,0 42,8 50,8 50,67 0,67
N$8
  pour Bottom (isolate 0.813): 0,8 8,8 8,0 42,0 42,8 50,8 50,67 0,67
N$9
  Top 0.406: STM32F03K6T6.23 | STM32F03K6T6.23 32,31 32.66,31.66 JP1.2
N$10
  Top 0.406: R17.2 39.15,58.95 39.15,59.15 41,61 41,61.41 LED1.A
N$11
  Top 0.406: R20.2 36.01,59.01 38,61 38.55,61 LED2.A
  Top 0.61: LED2.A 38.66,61.1
N$12
  pour Top (isolate 0.61): 0,67 50,67 50,8 42,8 42,0 8,0 8,8 0,8
N$13
  Bottom 0.61: R36.2 39.5,53.55 OK2.1 40.68,51.77 C19.1
N$14
  Bottom 0.61: 42.48,59.27 OK1.1 43.48,59.27 C18.1 44.15,58.7 R23.2
N$15
  pour Top (isolate 0.813): 0,8 8,8 8,0 42,0 42,8 50,8 50,67 0,67
N$16
  Bottom 0.61: 21,53.33 IC6.2 | R11.2 21,53.33 | R2.2 23,53 22.67,53.33 21,53.33
N$17
  Top 0.406: 14.5,25 14,25 13.5,25.55 R37.2 | 14.5,25 17,25 19.8,27.8 STM32F03K6T6.6 | C23.2 14.5,25
  Top 0.61: R37.2 11.59,26.05 TR2.2
N$19
  Top 0.406: STM32F03K6T6.24 29.8,31.8 32.2,34.2 JP1.1
N$20
  Bottom 0.61: Q3.3 42.8,54 R36.1
N$21
  Bottom 0.61: R38.2 45.85,45.1 Q3.2
N$22
  Bottom 0.61: 19,57 20.95,57 R11.1 21,57.95 R16.1 | 19,57 18.51,55.51 IC6.1 | C15.2 19,57
N$23
  Top 0.61: R35.1 6.5,34.5 6,35 4.55,35 U$1.7
  Bottom 0.61: R12.1 11,49 6.5,44.5 6.5,37.5 4.46,35.46 U$1.7 4.13,35.5
N$24  (via drill 0.6)
  Top 0.61: v48.5,35.5 48.5,39.5 47.35,40.65 Q2.2
  Bottom 0.61: R39.2 v48.5,35.5
N$25
  Top 0.61: IC2.3 16.41,48.37 R24.2 14.95,47 R21.2
N$26
  Bottom 0.61: R14.2 13.31,49.04 13.31,50.36 | IC6.5 13.31,50.36 | 13.31,50.36 R12.2
N$27
  Bottom 0.61: IC6.6 13.3,52.05 11,52.05 | 11,52.05 R15.2 | 11,52.05 9,52.05 R13.2
N$28  (1 unrouted)
  Top 0.61: 10.56,32 10.53,31.96 U$1.8
  Bottom 0.61: R1.1 12,47 8,43 8,37 7.5,36.5 7.5,34.5 4.96,31.96 U$1.8
N$29
  Top 0.61: Q2.3 46.55,56.4 R19.1
N$30
  Bottom 0.61: IC6.7 11.67,53.33 12,53.3 11.05,53.3 R15.1 11,62.5 16.45,62.5 17.5,61.45 C31.2 R18.1
N$31
  Top 0.61: IC2.2 15.41,49.63 arc-90 R25.2 arc-90 14.95,50 R22.2
N$32
  Top 0.61: R30.1 14.95,52 R25.1 15.05,51.9 16.3,51.9 17.3,50.91 IC2.1 18.4,52.65 C34.2
N$35
  Top 0.61: R1_NTC.2 R3_NTC.2 23.6,45 IC2.5
N$36
  Top 0.61: IC2.6 26.2,48.37 R4_NTC.2 26.25,48.1 26.2,48.05 R2_NTC.2
N$39
  Top 0.61: IC2.7 25.64,49.63 26,50 25.85,50 R4_NTC.1 27.2,50.2 27.5,50.5 27.5,56.5 27,57 18,57 18,55.05 C35.2 R31.1
PLUS_12  (via drill 0.6)
  Top 0.61: v47,17 47,34 45,36 45,46 43.6,47.4 Q3.1 43.5,49.7 43.5,53 Q2.1
  Top 0.813: 37.4,11.1 U$2.P$2 D9.A | v34,14 33,13 15,13 11,9 3,9 1.2,10.8 v1.2,16 1.2,51.9 2.26,52.96 U$1.2
  Top 1.016: U$2.P$2 37.3,9 35.3,7 C7.1
  Bottom 0.61: IC3.9 1.2,15.55 v1.2,16 | D2.C 46.98,17 v47,17
  Bottom 0.813: v34,14 37.1,14 37.3,13.8
  Bottom 1.016: U$2.P$2 37.3,11.7 | 37.3,10.97 U$2.P$2 | D2.C 46,17 45,16 39.5,16 37.3,13.8 U$2.P$2 | D1.C 35.98,9.97 U$2.P$2
REL  (via drill 0.6)
  Top 0.406: STM32F03K6T6.11 24.21,23.21 v24,23
  Bottom 0.406: v24,23 22,23 | 22,23 15.25,23 IC3.2 | C24.1 22.5,23.5 22,23
  Bottom 0.61: IC3.7 IC3.6 IC3.5 IC3.4 IC3.3 IC3.2 IC3.1
RELAY_OUT
  Bottom 0.61: IC3.11 IC3.10
  Bottom 0.813: IC3.16 IC3.15 | IC3.15 IC3.14 IC3.13 IC3.12 IC3.11 | IC3.15 8.7,21.3 2.5,21.3 1.1,22.7 1.1,55.24 2.1,56.24 3.87,56.24 U$1.1
RS_A  (via drill 0.6)
  Top 0.61: 39.23,29.23 37,27 37,22.05 33.95,19 R7.1
  Top 0.813: 39.23,29.23 X3.4 | v33,18 32.95,18.05 R7.1
  Bottom 0.813: R9.2 32.7,17.7 v33,18
RS_B
  Top 0.406: 35.5,24.5 35.15,23.5 R10.1
  Top 0.61: X3.3 39.5,32 35.5,28 35.5,24.5 | 35.15,23.5 35.15,23.15 33,21 R8.1
RX
  Top 0.406: 20.7,21.3 IC8.1 20.6,21.3 20.6,21.81 22.6,23.81 STM32F03K6T6.9
SCL
  Top 0.406: JP3.3 30.35,64.65 29.5,63.8 29.5,43.5 27,41 26,41 25,40 25,39.19 JP2.4 25,38.81 25,34 25.01,33.99 STM32F03K6T6.29
  Bottom 0.61: IC4.6 29.36,63.37 30,64 30,64.65 JP3.3
SDA
  Top 0.406: JP3.4 27.81,60.19 28.5,59.5 28.5,44 26.5,42 23.9,42 22.27,40.37 JP2.3 22.6,38.67 22.6,38 24.21,36.39 STM32F03K6T6.30
  Bottom 0.406: 28,61.11 IC4.5
  Bottom 0.61: IC4.5 28.09,64.72 JP3.4
TX
  Top 0.406: IC8.4 19.5,17.5 19,18 19,24.09 STM32F03K6T6.8
(copper drawn outside any net)
  shapes: Bottom area x4